# EAGLE schematic SuperCapacitor Schmatic (EAGLE 9.5.0)
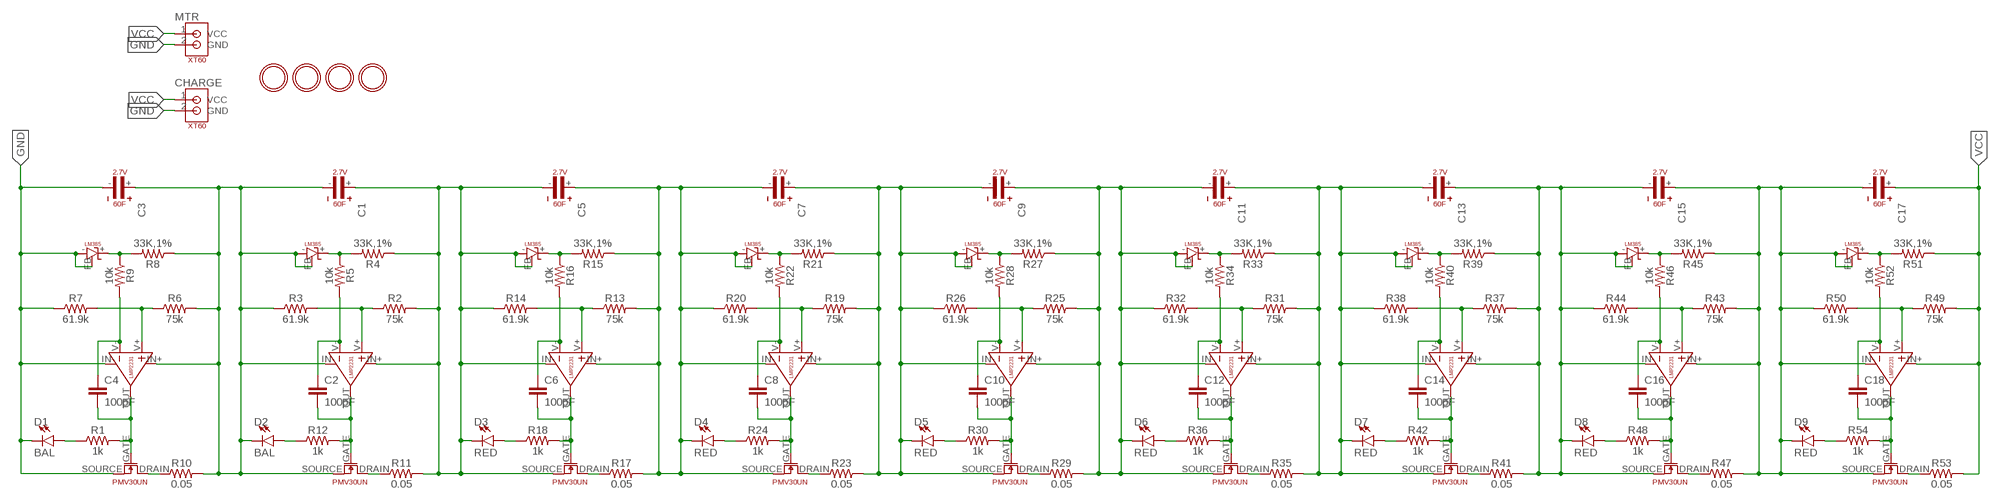
[diagram p0: schematic, sheet 1]

## Parts
C1  2.7V 60F  2.7V_60F  [2.7V_60F]
C2  100pF  100PF-0603-50V-5%  [0603]
C3  2.7V 60F  2.7V_60F  [2.7V_60F]
C4  100pF  100PF-0603-50V-5%  [0603]
C5  2.7V 60F  2.7V_60F  [2.7V_60F]
C6  100pF  100PF-0603-50V-5%  [0603]
C7  2.7V 60F  2.7V_60F  [2.7V_60F]
C8  100pF  100PF-0603-50V-5%  [0603]
C9  2.7V 60F  2.7V_60F  [2.7V_60F]
C10  100pF  100PF-0603-50V-5%  [0603]
C11  2.7V 60F  2.7V_60F  [2.7V_60F]
C12  100pF  100PF-0603-50V-5%  [0603]
C13  2.7V 60F  2.7V_60F  [2.7V_60F]
C14  100pF  100PF-0603-50V-5%  [0603]
C15  2.7V 60F  2.7V_60F  [2.7V_60F]
C16  100pF  100PF-0603-50V-5%  [0603]
C17  2.7V 60F  2.7V_60F  [2.7V_60F]
C18  100pF  100PF-0603-50V-5%  [0603]
CHARGE  XT60  [XT60]
D1  BAL  LED-RED0603  [LED-0603]
D2  BAL  LED-RED0603  [LED-0603]
D3  RED  LED-RED0603  [LED-0603]
D4  RED  LED-RED0603  [LED-0603]
D5  RED  LED-RED0603  [LED-0603]
D6  RED  LED-RED0603  [LED-0603]
D7  RED  LED-RED0603  [LED-0603]
D8  RED  LED-RED0603  [LED-0603]
D9  RED  LED-RED0603  [LED-0603]
MTR  XT60  [XT60]
R1  1k  1KOHM-0603-1/10W-1%  [0603]
R2  75k  75KOHM-0603-1/10W-1%  [0603]
R3  61.9k  75KOHM-0603-1/10W-1%  [0603]
R4  33K,1%  1MOHM-0603-1/4W-5%  [0603]
R5  10k  10KOHM-0603-1/10W-1%  [0603]
R6  75k  75KOHM-0603-1/10W-1%  [0603]
R7  61.9k  75KOHM-0603-1/10W-1%  [0603]
R8  33K,1%  1MOHM-0603-1/4W-5%  [0603]
R9  10k  10KOHM-0603-1/10W-1%  [0603]
R10  0.05  0.05OHM-2512-3W-1%  [2512]
R11  0.05  0.05OHM-2512-3W-1%  [2512]
R12  1k  1KOHM-0603-1/10W-1%  [0603]
R13  75k  75KOHM-0603-1/10W-1%  [0603]
R14  61.9k  75KOHM-0603-1/10W-1%  [0603]
R15  33K,1%  1MOHM-0603-1/4W-5%  [0603]
R16  10k  10KOHM-0603-1/10W-1%  [0603]
R17  0.05  0.05OHM-2512-3W-1%  [2512]
R18  1k  1KOHM-0603-1/10W-1%  [0603]
R19  75k  75KOHM-0603-1/10W-1%  [0603]
R20  61.9k  75KOHM-0603-1/10W-1%  [0603]
R21  33K,1%  1MOHM-0603-1/4W-5%  [0603]
R22  10k  10KOHM-0603-1/10W-1%  [0603]
R23  0.05  0.05OHM-2512-3W-1%  [2512]
R24  1k  1KOHM-0603-1/10W-1%  [0603]
R25  75k  75KOHM-0603-1/10W-1%  [0603]
R26  61.9k  75KOHM-0603-1/10W-1%  [0603]
R27  33K,1%  1MOHM-0603-1/4W-5%  [0603]
R28  10k  10KOHM-0603-1/10W-1%  [0603]
R29  0.05  0.05OHM-2512-3W-1%  [2512]
R30  1k  1KOHM-0603-1/10W-1%  [0603]
R31  75k  75KOHM-0603-1/10W-1%  [0603]
R32  61.9k  75KOHM-0603-1/10W-1%  [0603]
R33  33K,1%  1MOHM-0603-1/4W-5%  [0603]
R34  10k  10KOHM-0603-1/10W-1%  [0603]
R35  0.05  0.05OHM-2512-3W-1%  [2512]
R36  1k  1KOHM-0603-1/10W-1%  [0603]
R37  75k  75KOHM-0603-1/10W-1%  [0603]
R38  61.9k  75KOHM-0603-1/10W-1%  [0603]
R39  33K,1%  1MOHM-0603-1/4W-5%  [0603]
R40  10k  10KOHM-0603-1/10W-1%  [0603]
R41  0.05  0.05OHM-2512-3W-1%  [2512]
R42  1k  1KOHM-0603-1/10W-1%  [0603]
R43  75k  75KOHM-0603-1/10W-1%  [0603]
R44  61.9k  75KOHM-0603-1/10W-1%  [0603]
R45  33K,1%  1MOHM-0603-1/4W-5%  [0603]
R46  10k  10KOHM-0603-1/10W-1%  [0603]
R47  0.05  0.05OHM-2512-3W-1%  [2512]
R48  1k  1KOHM-0603-1/10W-1%  [0603]
R49  75k  75KOHM-0603-1/10W-1%  [0603]
R50  61.9k  75KOHM-0603-1/10W-1%  [0603]
R51  33K,1%  1MOHM-0603-1/4W-5%  [0603]
R52  10k  10KOHM-0603-1/10W-1%  [0603]
R53  0.05  0.05OHM-2512-3W-1%  [2512]
R54  1k  1KOHM-0603-1/10W-1%  [0603]
U$1  LMP2231  [LMP2231_SOT23_5]
U$2  LM385  [LM385_SOT23]
U$3  PMV30UN_MOS  [PMV30UN_SOT23]
U$4  LMP2231  [LMP2231_SOT23_5]
U$5  LM385  [LM385_SOT23]
U$6  PMV30UN_MOS  [PMV30UN_SOT23]
U$7  LMP2231  [LMP2231_SOT23_5]
U$8  LM385  [LM385_SOT23]
U$9  PMV30UN_MOS  [PMV30UN_SOT23]
U$10  LMP2231  [LMP2231_SOT23_5]
U$11  LM385  [LM385_SOT23]
U$12  PMV30UN_MOS  [PMV30UN_SOT23]
U$13  LMP2231  [LMP2231_SOT23_5]
U$14  LM385  [LM385_SOT23]
U$15  PMV30UN_MOS  [PMV30UN_SOT23]
U$16  LMP2231  [LMP2231_SOT23_5]
U$17  LM385  [LM385_SOT23]
U$18  PMV30UN_MOS  [PMV30UN_SOT23]
U$19  LMP2231  [LMP2231_SOT23_5]
U$20  LM385  [LM385_SOT23]
U$21  PMV30UN_MOS  [PMV30UN_SOT23]
U$22  LMP2231  [LMP2231_SOT23_5]
U$23  LM385  [LM385_SOT23]
U$24  PMV30UN_MOS  [PMV30UN_SOT23]
U$25  LMP2231  [LMP2231_SOT23_5]
U$26  LM385  [LM385_SOT23]
U$27  PMV30UN_MOS  [PMV30UN_SOT23]
U$30  M5  [M5]
U$31  M5  [M5]
U$32  M5  [M5]
U$33  M5  [M5]

## Nets
1 [discharge]: R17.P$1 U$9.DRAIN
GND [discharge]: C3.- CHARGE.2(GND) D1.C MTR.2(GND) R7.1 U$4.IN- U$5.- U$5.FB U$6.SOURCE
N$1: D1.A R1.1
N$3: C2.2 R12.2 U$1.OUT U$3.GATE
N$4 [discharge]: C1.- C3.+ D2.C R3.1 R6.2 R8.1 R10.P$2 U$1.IN- U$2.- U$2.FB U$3.SOURCE U$4.IN+
N$5: R2.1 R3.2 U$1.V+
N$6: C2.1 R5.2 U$1.V-
N$7: R4.2 R5.1 U$2.+
N$9: C4.2 R1.2 U$4.OUT U$6.GATE
N$11: R6.1 R7.2 U$4.V+
N$12: C4.1 R9.2 U$4.V-
N$13: R8.2 R9.1 U$5.+
N$14 [discharge]: R10.P$1 U$6.DRAIN
N$15 [discharge]: R11.P$1 U$3.DRAIN
N$16: D2.A R12.1
N$18: C6.2 R18.2 U$7.OUT U$9.GATE
N$19 [discharge]: C1.+ C5.- D3.C R2.2 R4.1 R11.P$2 R14.1 U$1.IN+ U$7.IN- U$8.- U$8.FB U$9.SOURCE
N$20: R13.1 R14.2 U$7.V+
N$21: C6.1 R16.2 U$7.V-
N$22: R15.2 R16.1 U$8.+
N$24: D3.A R18.1
N$26: C8.2 R24.2 U$10.OUT U$12.GATE
N$27 [discharge]: C5.+ C7.- D4.C R13.2 R15.1 R17.P$2 R20.1 U$7.IN+ U$10.IN- U$11.- U$11.FB U$12.SOURCE
N$28: R19.1 R20.2 U$10.V+
N$29: C8.1 R22.2 U$10.V-
N$30: R21.2 R22.1 U$11.+
N$31 [discharge]: R23.P$1 U$12.DRAIN
N$32: D4.A R24.1
N$34: C10.2 R30.2 U$13.OUT U$15.GATE
N$35 [discharge]: C7.+ C9.- D5.C R19.2 R21.1 R23.P$2 R26.1 U$10.IN+ U$13.IN- U$14.- U$14.FB U$15.SOURCE
N$36: R25.1 R26.2 U$13.V+
N$37: C10.1 R28.2 U$13.V-
N$38: R27.2 R28.1 U$14.+
N$39 [discharge]: R29.P$1 U$15.DRAIN
N$40: D5.A R30.1
N$42: C12.2 R36.2 U$16.OUT U$18.GATE
N$43 [discharge]: C9.+ C11.- D6.C R25.2 R27.1 R29.P$2 R32.1 U$13.IN+ U$16.IN- U$17.- U$17.FB U$18.SOURCE
N$44: R31.1 R32.2 U$16.V+
N$45: C12.1 R34.2 U$16.V-
N$46: R33.2 R34.1 U$17.+
N$47 [discharge]: R35.P$1 U$18.DRAIN
N$48: D6.A R36.1
N$50: C14.2 R42.2 U$19.OUT U$21.GATE
N$51 [discharge]: C11.+ C13.- D7.C R31.2 R33.1 R35.P$2 R38.1 U$16.IN+ U$19.IN- U$20.- U$20.FB U$21.SOURCE
N$52: R37.1 R38.2 U$19.V+
N$53: C14.1 R40.2 U$19.V-
N$54: R39.2 R40.1 U$20.+
N$55 [discharge]: R41.P$1 U$21.DRAIN
N$56: D7.A R42.1
N$58: C16.2 R48.2 U$22.OUT U$24.GATE
N$59: C13.+ C15.- D8.C R37.2 R39.1 R41.P$2 R44.1 U$19.IN+ U$22.IN- U$23.- U$23.FB U$24.SOURCE
N$60: R43.1 R44.2 U$22.V+
N$61: C16.1 R46.2 U$22.V-
N$62: R45.2 R46.1 U$23.+
N$63 [discharge]: R47.P$1 U$24.DRAIN
N$64: D8.A R48.1
N$66: C18.2 R54.2 U$25.OUT U$27.GATE
N$67 [discharge]: C15.+ C17.- D9.C R43.2 R45.1 R47.P$2 R50.1 U$22.IN+ U$25.IN- U$26.- U$26.FB U$27.SOURCE
N$68: R49.1 R50.2 U$25.V+
N$69: C18.1 R52.2 U$25.V-
N$70: R51.2 R52.1 U$26.+
N$71 [discharge]: R53.P$1 U$27.DRAIN
N$72: D9.A R54.1
VCC [discharge]: C17.+ CHARGE.1(VCC) MTR.1(VCC) R49.2 R51.1 R53.P$2 U$25.IN+

## Library data of the parts
C1 C3 C5 C7 C9 C11 C13 C15 C17 = personal Made:2.7V_60F
C2 C4 C6 C8 C10 C12 C14 C16 C18 = SparkFun-Capacitors:100PF: 100pF/0.1nF ceramic capacitors A capacitor is a passive two-terminal electrical component used to store electrical energy temporarily in an electric field.; PROD_ID: CAP-07883
CHARGE MTR = NewKevinMade:XT60
D1 D2 = SparkFun-LED:LED-RED: Red SMD LED Used in manufacturing of most products at SparkFun Packages: 0603 - SMD 0603 package [Product Link] <http://docs.avagotech.com/docs/AV02-0551EN> 0603 SMART - SMD 0603 SMART package ( more efficient and expensive)[Product Link] <http://www.osram-os.com/Graphics/XPic2/00077099_0.pdf> 1206 - SMD1206 package [Product Link] <https://www.sparkfun.com/datasheets/DevTools/LilyPad/Q150OVS4.pdff> SparkFun Products: Pro Mini 328 -5V <https://www.sparkfun.com/products/821> RedBoard <https://www.sparkfun.com/products/12757> IOIO-OTG <https://www.sparkfun.com/products/13613>; PROD_ID: DIO-00819; VALUE: RED
D3-D9 = SparkFun-LED:LED-RED: Red SMD LED Used in manufacturing of most products at SparkFun Packages: 0603 - SMD 0603 package [Product Link] <http://docs.avagotech.com/docs/AV02-0551EN> 0603 SMART - SMD 0603 SMART package ( more efficient and expensive)[Product Link] <http://www.osram-os.com/Graphics/XPic2/00077099_0.pdf> 1206 - SMD1206 package [Product Link] <https://www.sparkfun.com/datasheets/DevTools/LilyPad/Q150OVS4.pdff> SparkFun Products: Pro Mini 328 -5V <https://www.sparkfun.com/products/821> RedBoard <https://www.sparkfun.com/products/12757> IOIO-OTG <https://www.sparkfun.com/products/13613>; PROD_ID: DIO-00819
R1 R12 R18 R24 R30 R36 R42 R48 R54 = SparkFun-Resistors:1KOHM: 1kΩ resistor A resistor is a passive two-terminal electrical component that implements electrical resistance as a circuit element. Resistors act to reduce current flow, and, at the same time, act to lower voltage levels within circuits. - Wikipedia; PROD_ID: RES-07856
R2 R3 R6 R7 R13 R14 R19 R20 R25 R26 R31 R32 R37 R38 R43 R44 R49 R50 = SparkFun-Resistors:75KOHM: 75Ω resistor A resistor is a passive two-terminal electrical component that implements electrical resistance as a circuit element. Resistors act to reduce current flow, and, at the same time, act to lower voltage levels within circuits. - Wikipedia; PROD_ID: RES-09737; VALUE: 75
R4 R8 R15 R21 R27 R33 R39 R45 R51 = SparkFun-Resistors:1MOHM: 1MΩ resistor A resistor is a passive two-terminal electrical component that implements electrical resistance as a circuit element. Resistors act to reduce current flow, and, at the same time, act to lower voltage levels within circuits. - Wikipedia; PROD_ID: RES-07868; VALUE: 1M
R5 R9 R16 R22 R28 R34 R40 R46 R52 = SparkFun-Resistors:10KOHM: 10kΩ resistor A resistor is a passive two-terminal electrical component that implements electrical resistance as a circuit element. Resistors act to reduce current flow, and, at the same time, act to lower voltage levels within circuits. - Wikipedia; PROD_ID: RES-00824
R10 R11 R17 R23 R29 R35 R41 R47 R53 = SparkFun-Resistors:0.05OHM: 0.05Ω resistor A resistor is a passive two-terminal electrical component that implements electrical resistance as a circuit element. Resistors act to reduce current flow, and, at the same time, act to lower voltage levels within circuits. - Wikipedia; PROD_ID: RES-13771
U$1 U$4 U$7 U$10 U$13 U$16 U$19 U$22 U$25 = personal Made:LMP2231
U$2 U$5 U$8 U$11 U$14 U$17 U$20 U$23 U$26 = personal Made:LM385
U$3 U$6 U$9 U$12 U$15 U$18 U$21 U$24 U$27 = personal Made:PMV30UN_MOS
U$30-U$33 = NewKevinMade:M5

## Net classes
1 discharge: width 0.305 mm, drill 0.305 mm, clearance 0.152 mm